# EAGLE schematic pcb l4 v18 (EAGLE 9.7.0)

## Sheet 1 of 6
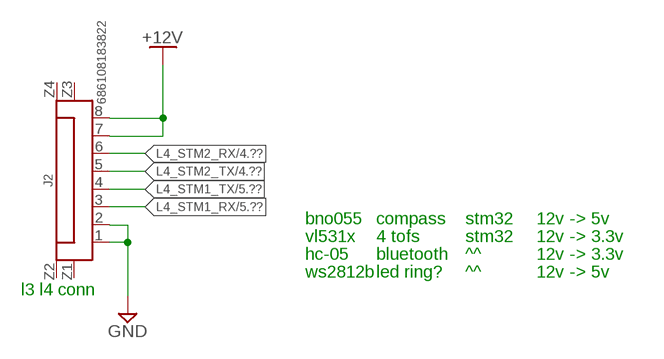
[diagram p0: schematic, sheet 1]

### Parts
J2  686108183822  6861XX183822_686108183822  [686108183822]

### Nets
+12V: J2.7 J2.8 ; also sheet 3
GND: J2.1 J2.2 ; also sheet 2,3,4,5,6
L4_STM1_RX: J2.3 ; also sheet 5
L4_STM1_TX: J2.4 ; also sheet 5
L4_STM2_RX: J2.6 ; also sheet 4
L4_STM2_TX: J2.5 ; also sheet 4
Unconnected: J2.Z1 J2.Z2 J2.Z3 J2.Z4

### Notes on the sheet
- bno055 | compass | stm32 | 12v -> 5v
- vl531x | 4 tofs | stm32 | 12v -> 3.3v
- hc-05 | bluetooth | ^^ | 12v -> 3.3v
- ws2812b | led ring? | ^^ | 12v -> 5v
- l3 l4 conn

## Sheet 2 of 6
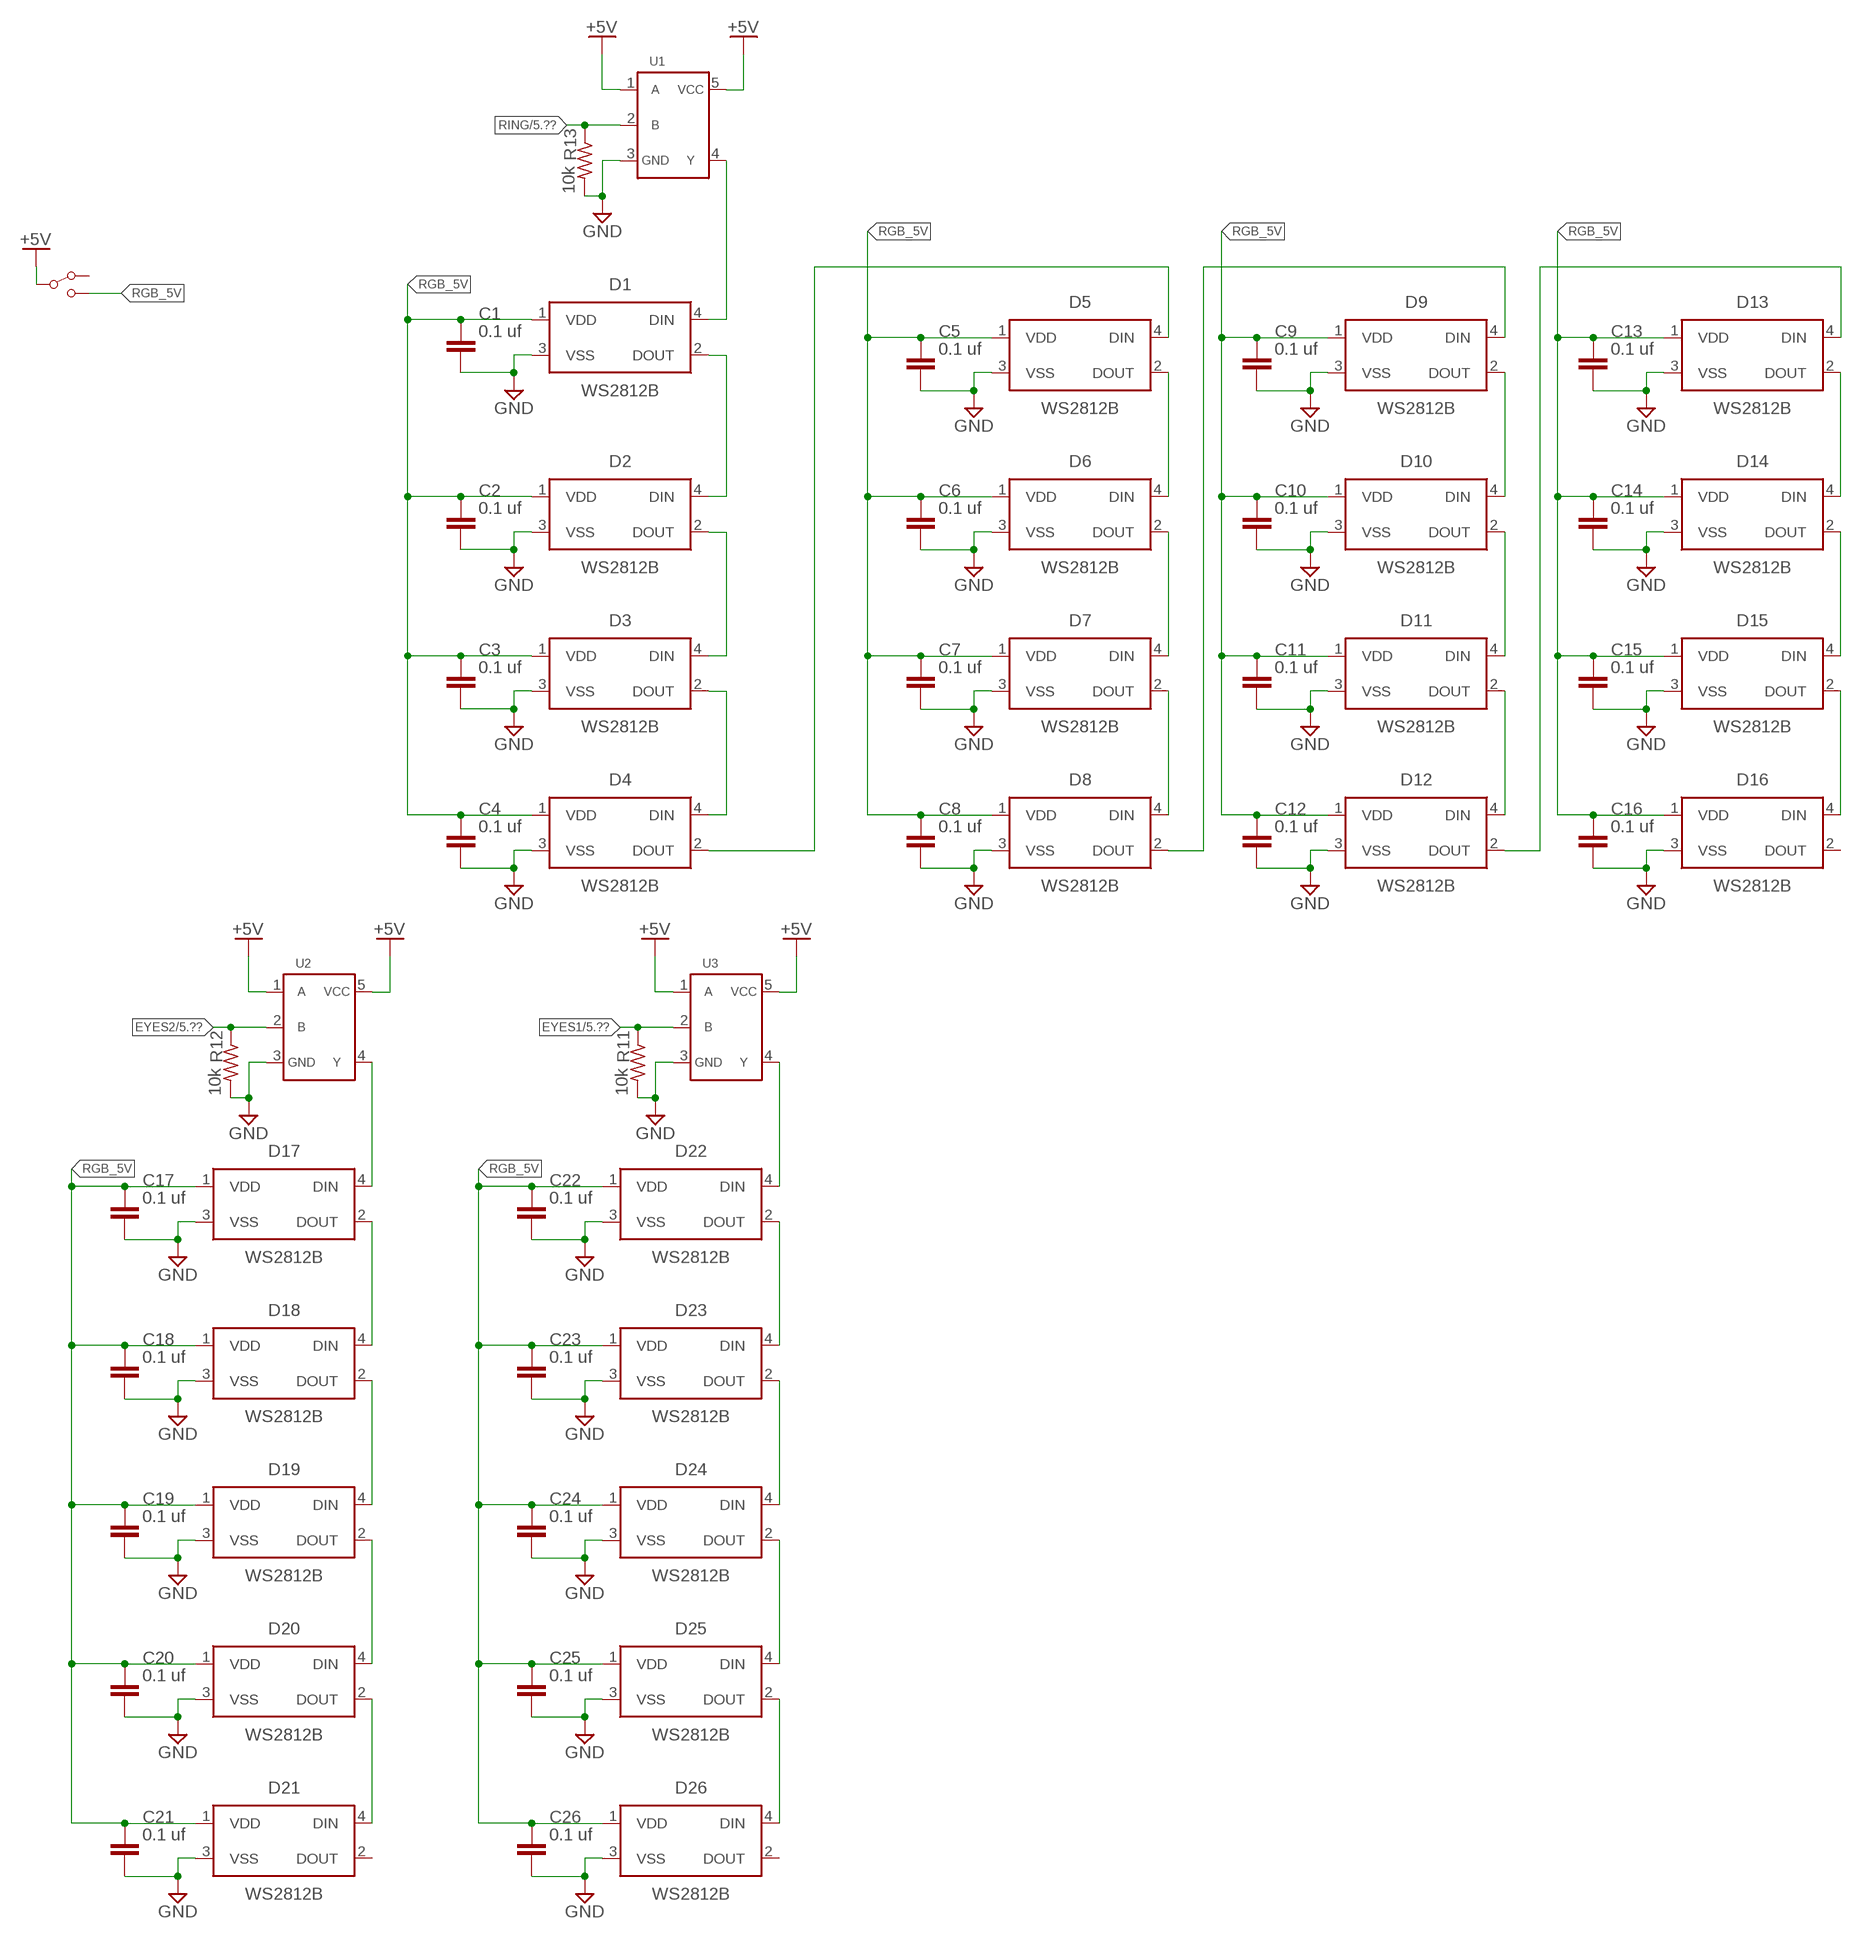
[diagram p1: schematic, sheet 2]

### Parts
C1  0.1 uf  C_CHIP-0603(1608-METRIC)  [CAPC1608X85]
C2  0.1 uf  C_CHIP-0603(1608-METRIC)  [CAPC1608X85]
C3  0.1 uf  C_CHIP-0603(1608-METRIC)  [CAPC1608X85]
C4  0.1 uf  C_CHIP-0603(1608-METRIC)  [CAPC1608X85]
C5  0.1 uf  C_CHIP-0603(1608-METRIC)  [CAPC1608X85]
C6  0.1 uf  C_CHIP-0603(1608-METRIC)  [CAPC1608X85]
C7  0.1 uf  C_CHIP-0603(1608-METRIC)  [CAPC1608X85]
C8  0.1 uf  C_CHIP-0603(1608-METRIC)  [CAPC1608X85]
C9  0.1 uf  C_CHIP-0603(1608-METRIC)  [CAPC1608X85]
C10  0.1 uf  C_CHIP-0603(1608-METRIC)  [CAPC1608X85]
C11  0.1 uf  C_CHIP-0603(1608-METRIC)  [CAPC1608X85]
C12  0.1 uf  C_CHIP-0603(1608-METRIC)  [CAPC1608X85]
C13  0.1 uf  C_CHIP-0603(1608-METRIC)  [CAPC1608X85]
C14  0.1 uf  C_CHIP-0603(1608-METRIC)  [CAPC1608X85]
C15  0.1 uf  C_CHIP-0603(1608-METRIC)  [CAPC1608X85]
C16  0.1 uf  C_CHIP-0603(1608-METRIC)  [CAPC1608X85]
C17  0.1 uf  C_CHIP-0603(1608-METRIC)  [CAPC1608X85]
C18  0.1 uf  C_CHIP-0603(1608-METRIC)  [CAPC1608X85]
C19  0.1 uf  C_CHIP-0603(1608-METRIC)  [CAPC1608X85]
C20  0.1 uf  C_CHIP-0603(1608-METRIC)  [CAPC1608X85]
C21  0.1 uf  C_CHIP-0603(1608-METRIC)  [CAPC1608X85]
C22  0.1 uf  C_CHIP-0603(1608-METRIC)  [CAPC1608X85]
C23  0.1 uf  C_CHIP-0603(1608-METRIC)  [CAPC1608X85]
C24  0.1 uf  C_CHIP-0603(1608-METRIC)  [CAPC1608X85]
C25  0.1 uf  C_CHIP-0603(1608-METRIC)  [CAPC1608X85]
C26  0.1 uf  C_CHIP-0603(1608-METRIC)  [CAPC1608X85]
D1  WS2812B  [WS2812B]
D2  WS2812B  [WS2812B]
D3  WS2812B  [WS2812B]
D4  WS2812B  [WS2812B]
D5  WS2812B  [WS2812B]
D6  WS2812B  [WS2812B]
D7  WS2812B  [WS2812B]
D8  WS2812B  [WS2812B]
D9  WS2812B  [WS2812B]
D10  WS2812B  [WS2812B]
D11  WS2812B  [WS2812B]
D12  WS2812B  [WS2812B]
D13  WS2812B  [WS2812B]
D14  WS2812B  [WS2812B]
D15  WS2812B  [WS2812B]
D16  WS2812B  [WS2812B]
D17  WS2812B  [WS2812B]
D18  WS2812B  [WS2812B]
D19  WS2812B  [WS2812B]
D20  WS2812B  [WS2812B]
D21  WS2812B  [WS2812B]
D22  WS2812B  [WS2812B]
D23  WS2812B  [WS2812B]
D24  WS2812B  [WS2812B]
D25  WS2812B  [WS2812B]
D26  WS2812B  [WS2812B]
R11  10k  R-US_CHIP-0603(1608-METRIC)  [RESC1608X60]
R12  10k  R-US_CHIP-0603(1608-METRIC)  [RESC1608X60]
R13  10k  R-US_CHIP-0603(1608-METRIC)  [RESC1608X60]
S1  SPDT-SLIDE-SWITCHSWITCH-TH  [SWITCH-TH]
U1  SN74AHCT1G08  [SOT23-5]
U2  SN74AHCT1G08  [SOT23-5]
U3  SN74AHCT1G08  [SOT23-5]

### Nets
+5V: S1.P$2 U1.1 U1.5 U2.1 U2.5 U3.1 U3.5 ; also sheet 3,6
EYES1: R11.1 U3.2 ; also sheet 5
EYES2: R12.1 U2.2 ; also sheet 5
GND: C1.2 C2.2 C3.2 C4.2 C5.2 C6.2 C7.2 C8.2 C9.2 C10.2 C11.2 C12.2 C13.2 C14.2 C15.2 C16.2 C17.2 C18.2 C19.2 C20.2 C21.2 C22.2 C23.2 C24.2 C25.2 C26.2 D1.3(VSS) D2.3(VSS) D3.3(VSS) D4.3(VSS) D5.3(VSS) D6.3(VSS) D7.3(VSS) D8.3(VSS) D9.3(VSS) D10.3(VSS) D11.3(VSS) D12.3(VSS) D13.3(VSS) D14.3(VSS) D15.3(VSS) D16.3(VSS) D17.3(VSS) D18.3(VSS) D19.3(VSS) D20.3(VSS) D21.3(VSS) D22.3(VSS) D23.3(VSS) D24.3(VSS) D25.3(VSS) D26.3(VSS) R11.2 R12.2 R13.2 U1.3 U2.3 U3.3 ; also sheet 1,3,4,5,6
N$7: D1.2(DOUT) D2.4(DIN)
N$8: D2.2(DOUT) D3.4(DIN)
N$9: D3.2(DOUT) D4.4(DIN)
N$10: D9.2(DOUT) D10.4(DIN)
N$11: D10.2(DOUT) D11.4(DIN)
N$12: D1.4(DIN) U1.4
N$13: D11.2(DOUT) D12.4(DIN)
N$14: D15.2(DOUT) D16.4(DIN)
N$15: D14.2(DOUT) D15.4(DIN)
N$16: D13.2(DOUT) D14.4(DIN)
N$17: D5.2(DOUT) D6.4(DIN)
N$18: D6.2(DOUT) D7.4(DIN)
N$19: D7.2(DOUT) D8.4(DIN)
N$20: D8.2(DOUT) D9.4(DIN)
N$21: D12.2(DOUT) D13.4(DIN)
N$22: D4.2(DOUT) D5.4(DIN)
N$23: D20.2(DOUT) D21.4(DIN)
N$24: D19.2(DOUT) D20.4(DIN)
N$25: D18.2(DOUT) D19.4(DIN)
N$26: D17.2(DOUT) D18.4(DIN)
N$27: D22.2(DOUT) D23.4(DIN)
N$28: D23.2(DOUT) D24.4(DIN)
N$29: D24.2(DOUT) D25.4(DIN)
N$30: D25.2(DOUT) D26.4(DIN)
N$31: D22.4(DIN) U3.4
N$32: D17.4(DIN) U2.4
RGB_5V: C1.1 C2.1 C3.1 C4.1 C5.1 C6.1 C7.1 C8.1 C9.1 C10.1 C11.1 C12.1 C13.1 C14.1 C15.1 C16.1 C17.1 C18.1 C19.1 C20.1 C21.1 C22.1 C23.1 C24.1 C25.1 C26.1 D1.1(VDD) D2.1(VDD) D3.1(VDD) D4.1(VDD) D5.1(VDD) D6.1(VDD) D7.1(VDD) D8.1(VDD) D9.1(VDD) D10.1(VDD) D11.1(VDD) D12.1(VDD) D13.1(VDD) D14.1(VDD) D15.1(VDD) D16.1(VDD) D17.1(VDD) D18.1(VDD) D19.1(VDD) D20.1(VDD) D21.1(VDD) D22.1(VDD) D23.1(VDD) D24.1(VDD) D25.1(VDD) D26.1(VDD) S1.P$3
RING: R13.1 U1.2 ; also sheet 5
Unconnected: D16.2(DOUT) D21.2(DOUT) D26.2(DOUT) S1.P$1

## Sheet 3 of 6
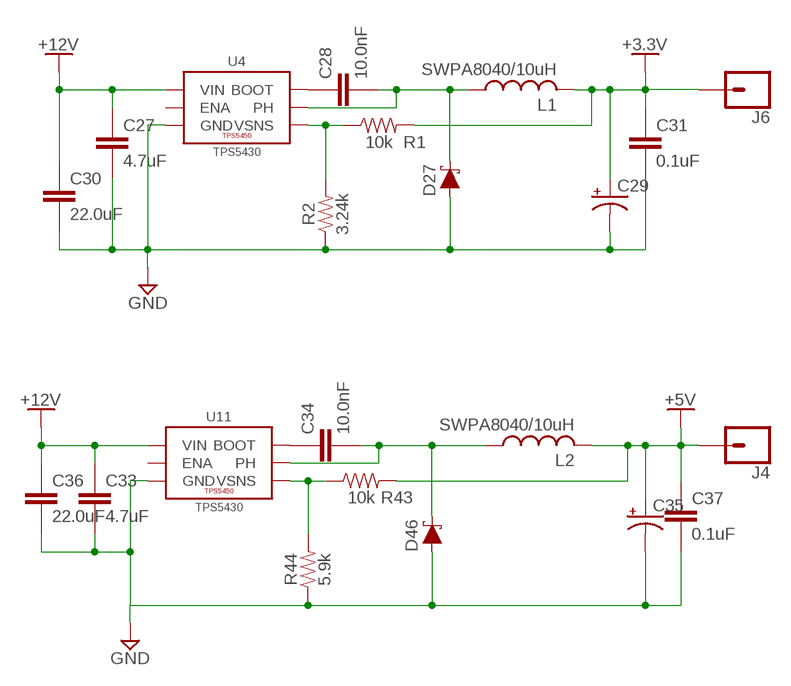
[diagram p2: schematic, sheet 3]

### Parts
C27  4.7uF  CAPACITOR0603  [C0603]
C28  10.0nF  CAPACITOR0603  [C0603]
C29  220uF  CPOL-USD/7343-31R  [D/7343-31R]
C30  22.0uF  CAPACITOR1210  [C1210]
C31  0.1uF  CAPACITOR0603  [C0603]
C33  4.7uF  CAPACITOR0603  [C0603]
C34  10.0nF  CAPACITOR0603  [C0603]
C35  220uF  CPOL-USD/7343-31R  [D/7343-31R]
C36  22.0uF  CAPACITOR1210  [C1210]
C37  0.1uF  CAPACITOR0603  [C0603]
D27  3A/40V/500mV  DIODE-SCHOTTKY-B340A  [SMA-DIODE]
D46  3A/40V/500mV  DIODE-SCHOTTKY-B340A  [SMA-DIODE]
J4  CONN_01  [1X01]
J6  CONN_01  [1X01]
L1  SWPA8040/10uH  INDUCTORSWPA8040  [SWPA8040]
L2  SWPA8040/10uH  INDUCTORSWPA8040  [SWPA8040]
R1  10k  RESISTOR0603  [R0603]
R2  3.24k  RESISTOR0603  [R0603]
R43  10k  RESISTOR0603  [R0603]
R44  5.9k  RESISTOR0603  [R0603]
U4  TPS5430  TPS5450  [POWERPAD-SOIC-8]
U11  TPS5430  TPS5450  [POWERPAD-SOIC-8]

### Nets
+3.3V: C29.+ C31.1 J6.1 L1.P2 R1.2 ; also sheet 4,5,6
+5V: C35.+ C37.1 J4.1 L2.P2 R43.2 ; also sheet 2,6
+12V: C27.1 C30.1 C33.1 C36.1 U4.7(VIN) U11.7(VIN) ; also sheet 1
GND: C27.2 C29.- C30.2 C31.2 C33.2 C35.- C36.2 C37.2 D27.A D46.A R2.1 R44.1 U4.6(GND) U4.9(GND) U4.P$1(GND) U4.P$2(GND) U4.P$3(GND) U4.P$4(GND) U4.P$5(GND) U4.P$6(GND) U11.6(GND) U11.9(GND) U11.P$1(GND) U11.P$2(GND) U11.P$3(GND) U11.P$4(GND) U11.P$5(GND) U11.P$6(GND) ; also sheet 1,2,4,5,6
N$6: C28.2 D27.C L1.P1 U4.8(PH)
N$33: R1.1 R2.2 U4.4(VSNS)
N$34: C28.1 U4.1(BOOT)
N$45: C34.2 D46.C L2.P1 U11.8(PH)
N$96: R43.1 R44.2 U11.4(VSNS)
N$97: C34.1 U11.1(BOOT)
Unconnected: U4.2(NC) U4.3(NC) U4.5(ENA) U11.2(NC) U11.3(NC) U11.5(ENA)

## Sheet 4 of 6
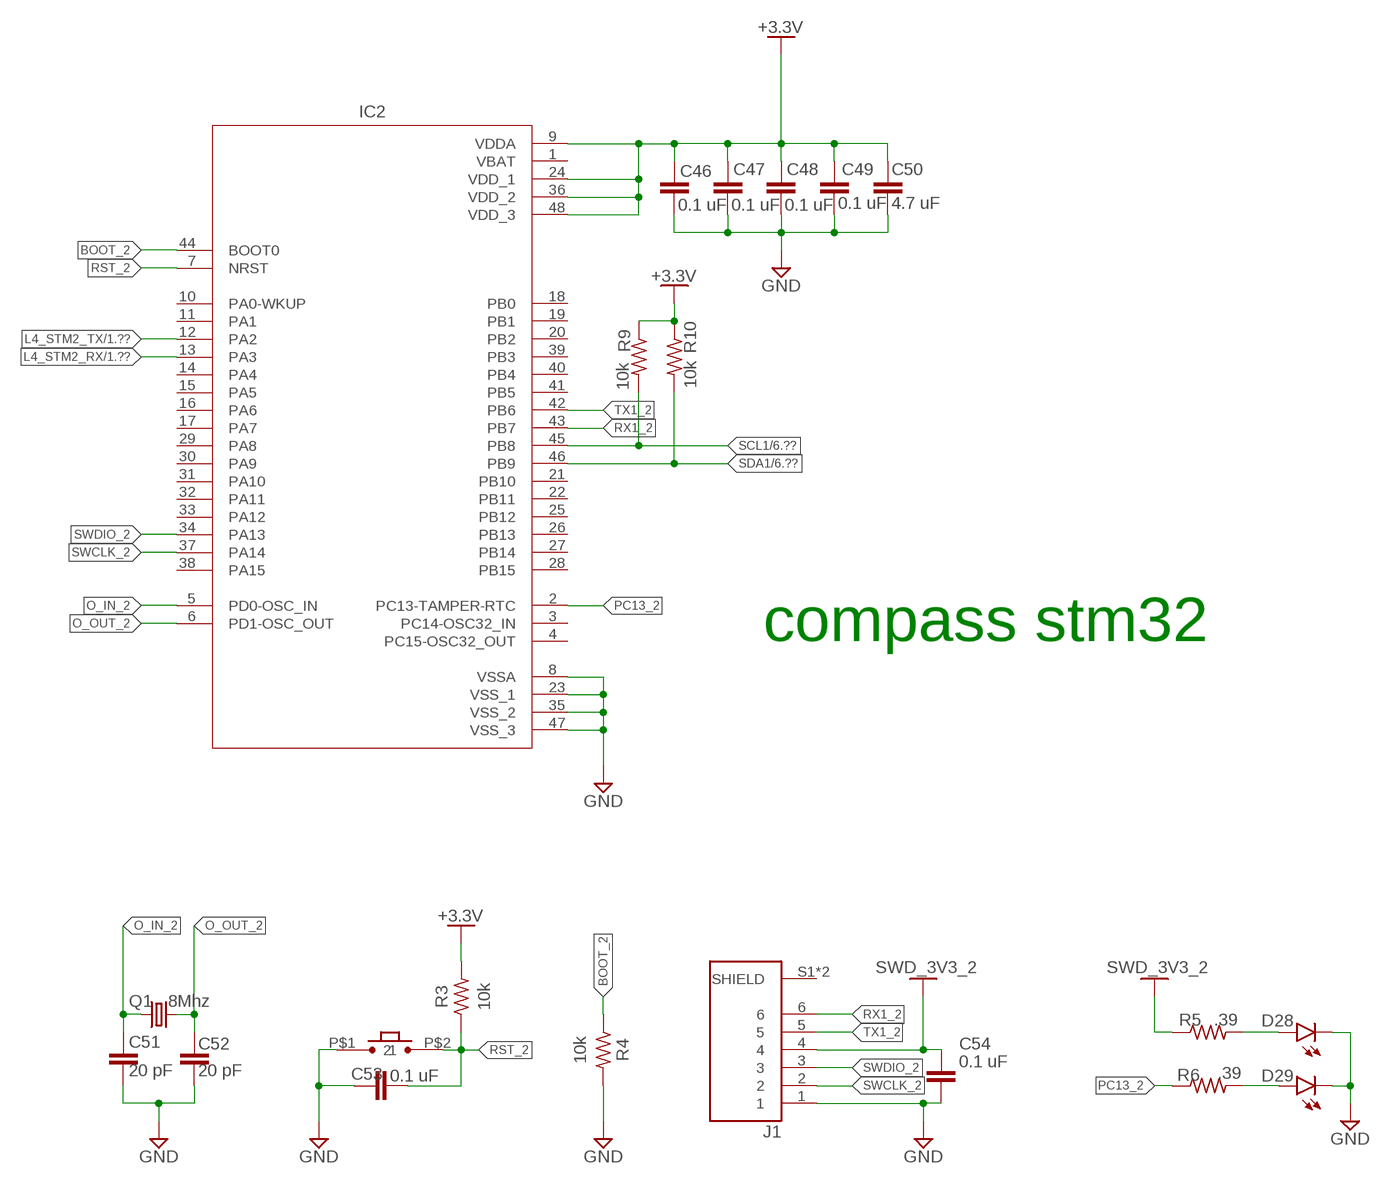
[diagram p3: schematic, sheet 4]

### Parts
C46  0.1 uF  C_CHIP-0603(1608-METRIC)  [CAPC1608X85]
C47  0.1 uF  C_CHIP-0603(1608-METRIC)  [CAPC1608X85]
C48  0.1 uF  C_CHIP-0603(1608-METRIC)  [CAPC1608X85]
C49  0.1 uF  C_CHIP-0603(1608-METRIC)  [CAPC1608X85]
C50  4.7 uF  C_CHIP-0603(1608-METRIC)  [CAPC1608X85]
C51  20 pF  C_CHIP-0603(1608-METRIC)  [CAPC1608X85]
C52  20 pF  C_CHIP-0603(1608-METRIC)  [CAPC1608X85]
C53  0.1 uF  C_CHIP-0603(1608-METRIC)  [CAPC1608X85]
C54  0.1 uF  C_CHIP-0603(1608-METRIC)  [CAPC1608X85]
D28  CHIP-FLAT-G_0603-0.35MM  [LEDC1608X35N_FLAT-G]
D29  CHIP-FLAT-G_0603-0.35MM  [LEDC1608X35N_FLAT-G]
IC2  STM32F103_QFP  [QFP50P900X900X160-48N]
J1  SM06B-SRSS-TB(LF)(SN)  [JST_SM06B-SRSS-TB(LF)(SN)]
Q1  8Mhz  CRYSTALCTS406  [CTS406]
R3  10k  R-US_CHIP-0603(1608-METRIC)  [RESC1608X60]
R4  10k  R-US_CHIP-0603(1608-METRIC)  [RESC1608X60]
R5  .39  R-US_CHIP-0603(1608-METRIC)  [RESC1608X60]
R6  .39  R-US_CHIP-0603(1608-METRIC)  [RESC1608X60]
R9  10k  R-US_CHIP-0603(1608-METRIC)  [RESC1608X60]
R10  10k  R-US_CHIP-0603(1608-METRIC)  [RESC1608X60]
U$2  SMOL_TACTILE_3X4MM  [SMOL_TACTILE_3X4MM]

### Nets
+3.3V: C46.1 C47.1 C48.1 C49.1 C50.1 IC2.9(VDDA) IC2.24(VDD_1) IC2.36(VDD_2) IC2.48(VDD_3) R3.2 R9.1 R10.1 ; also sheet 3,5,6
BOOT_2: IC2.44(BOOT0) R4.1
GND: C46.2 C47.2 C48.2 C49.2 C50.2 C51.2 C52.2 C53.1 C54.2 D28.C D29.C IC2.8(VSSA) IC2.23(VSS_1) IC2.35(VSS_2) IC2.47(VSS_3) J1.1 R4.2 U$2.P$1 ; also sheet 1,2,3,5,6
L4_STM2_RX: IC2.13(PA3) ; also sheet 1
L4_STM2_TX: IC2.12(PA2) ; also sheet 1
N$35: D28.A R5.2
N$36: D29.A R6.2
O_IN_2: C51.1 IC2.5(PD0-OSC_IN) Q1.1
O_OUT_2: C52.1 IC2.6(PD1-OSC_OUT) Q1.3
PC13_2: IC2.2(PC13-TAMPER-RTC) R6.1
RST_2: C53.2 IC2.7(NRST) R3.1 U$2.P$2
RX1_2: IC2.43(PB7) J1.6
SCL1: IC2.45(PB8) R9.2 ; also sheet 6
SDA1: IC2.46(PB9) R10.2 ; also sheet 6
SWCLK_2: IC2.37(PA14) J1.2
SWD_3V3_2: C54.1 J1.4 R5.1
SWDIO_2: IC2.34(PA13) J1.3
TX1_2: IC2.42(PB6) J1.5
Unconnected: IC2.3(PC14-OSC32_IN) IC2.4(PC15-OSC32_OUT) IC2.10(PA0-WKUP) IC2.11(PA1) IC2.14(PA4) IC2.15(PA5) IC2.16(PA6) IC2.17(PA7) IC2.18(PB0) IC2.19(PB1) IC2.20(PB2) IC2.21(PB10) IC2.22(PB11) IC2.25(PB12) IC2.26(PB13) IC2.27(PB14) IC2.28(PB15) IC2.29(PA8) IC2.30(PA9) IC2.31(PA10) IC2.32(PA11) IC2.33(PA12) IC2.38(PA15) IC2.39(PB3) IC2.40(PB4) IC2.41(PB5) J1.S1(SHIELD) J1.S2(SHIELD)

### Notes on the sheet
- compass stm32

## Sheet 5 of 6
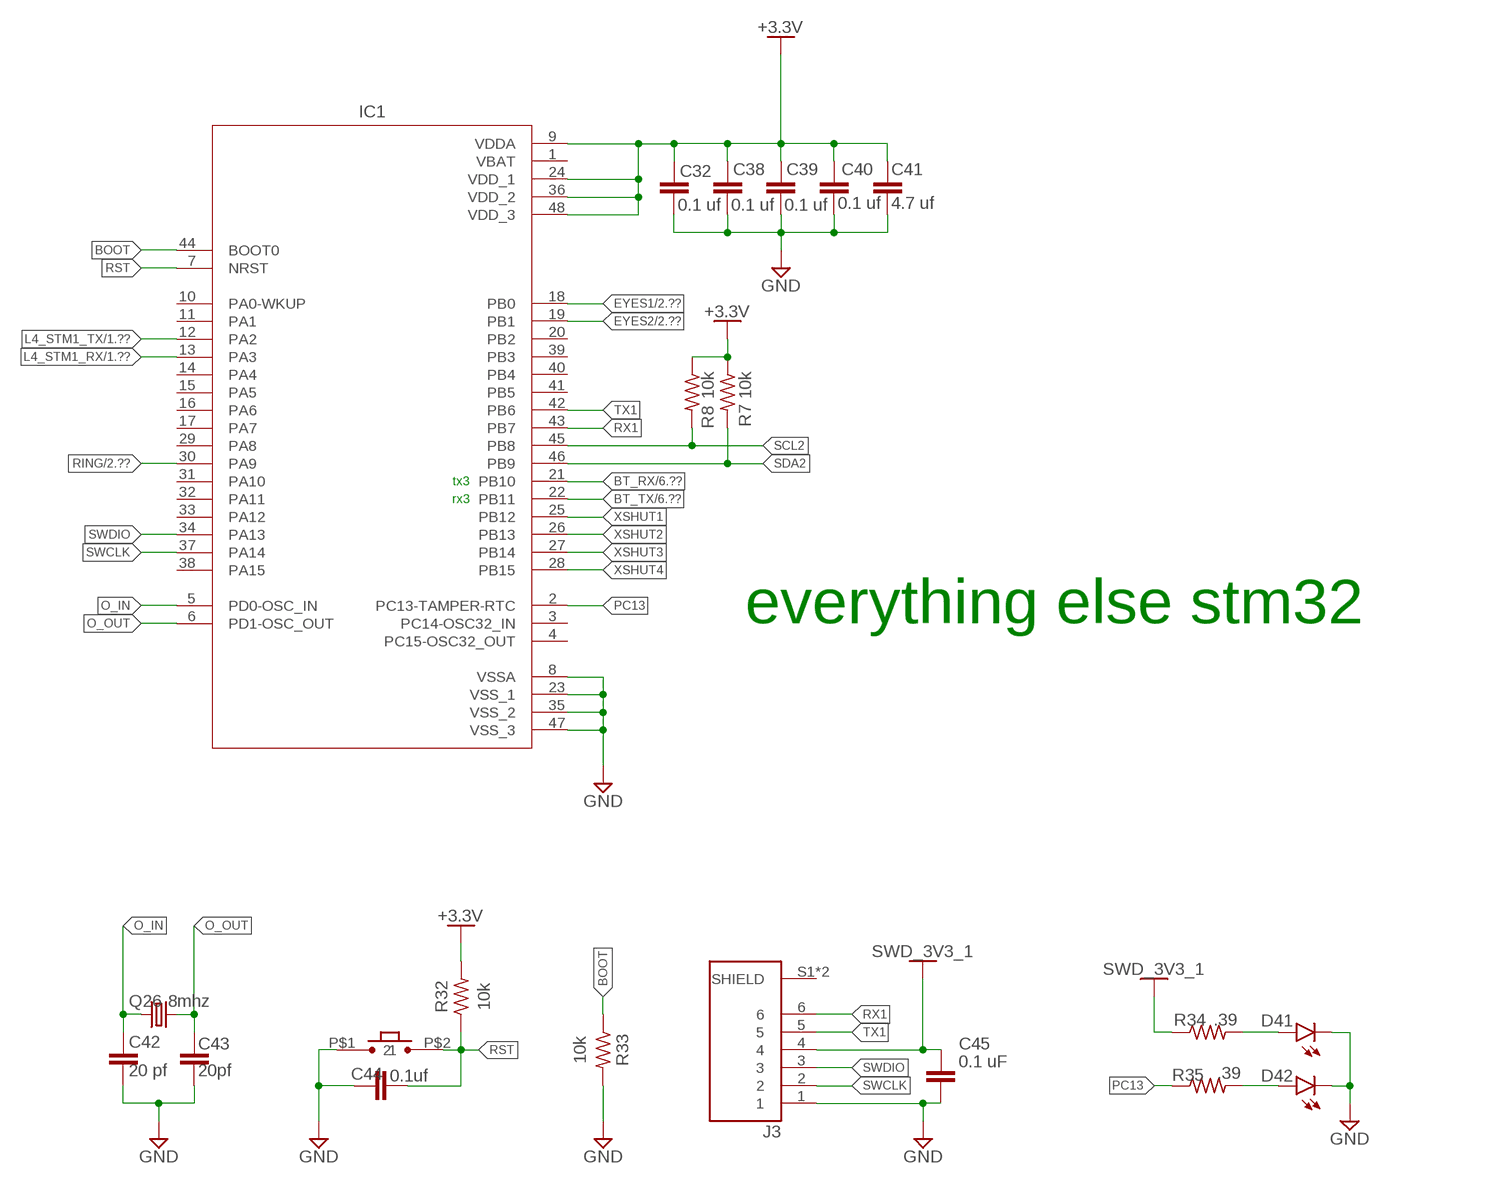
[diagram p4: schematic, sheet 5]

### Parts
C32  0.1 uf  C_CHIP-0603(1608-METRIC)  [CAPC1608X85]
C38  0.1 uf  C_CHIP-0603(1608-METRIC)  [CAPC1608X85]
C39  0.1 uf  C_CHIP-0603(1608-METRIC)  [CAPC1608X85]
C40  0.1 uf  C_CHIP-0603(1608-METRIC)  [CAPC1608X85]
C41  4.7 uf  C_CHIP-0603(1608-METRIC)  [CAPC1608X85]
C42  20 pf  C_CHIP-0603(1608-METRIC)  [CAPC1608X85]
C43  20pf  C_CHIP-0603(1608-METRIC)  [CAPC1608X85]
C44  0.1uf  C_CHIP-0603(1608-METRIC)  [CAPC1608X85]
C45  0.1 uF  C_CHIP-0603(1608-METRIC)  [CAPC1608X85]
D41  CHIP-FLAT-G_0603-0.35MM  [LEDC1608X35N_FLAT-G]
D42  CHIP-FLAT-G_0603-0.35MM  [LEDC1608X35N_FLAT-G]
IC1  STM32F103_QFP  [QFP50P900X900X160-48N]
J3  SM06B-SRSS-TB(LF)(SN)  [JST_SM06B-SRSS-TB(LF)(SN)]
Q26  8mhz  CRYSTALCTS406  [CTS406]
R7  10k  R-US_CHIP-0603(1608-METRIC)  [RESC1608X60]
R8  10k  R-US_CHIP-0603(1608-METRIC)  [RESC1608X60]
R32  10k  R-US_CHIP-0603(1608-METRIC)  [RESC1608X60]
R33  10k  R-US_CHIP-0603(1608-METRIC)  [RESC1608X60]
R34  .39  R-US_CHIP-0603(1608-METRIC)  [RESC1608X60]
R35  .39  R-US_CHIP-0603(1608-METRIC)  [RESC1608X60]
U$1  SMOL_TACTILE_3X4MM  [SMOL_TACTILE_3X4MM]

### Nets
+3.3V: C32.1 C38.1 C39.1 C40.1 C41.1 IC1.9(VDDA) IC1.24(VDD_1) IC1.36(VDD_2) IC1.48(VDD_3) R7.1 R8.1 R32.2 ; also sheet 3,4,6
BOOT: IC1.44(BOOT0) R33.1
BT_RX: IC1.21(PB10) ; also sheet 6
BT_TX: IC1.22(PB11) ; also sheet 6
EYES1: IC1.18(PB0) ; also sheet 2
EYES2: IC1.19(PB1) ; also sheet 2
GND: C32.2 C38.2 C39.2 C40.2 C41.2 C42.2 C43.2 C44.1 C45.2 D41.C D42.C IC1.8(VSSA) IC1.23(VSS_1) IC1.35(VSS_2) IC1.47(VSS_3) J3.1 R33.2 U$1.P$1 ; also sheet 1,2,3,4,6
L4_STM1_RX: IC1.13(PA3) ; also sheet 1
L4_STM1_TX: IC1.12(PA2) ; also sheet 1
N$46: D41.A R34.2
N$52: D42.A R35.2
O_IN: C42.1 IC1.5(PD0-OSC_IN) Q26.1
O_OUT: C43.1 IC1.6(PD1-OSC_OUT) Q26.3
PC13: IC1.2(PC13-TAMPER-RTC) R35.1
RING: IC1.30(PA9) ; also sheet 2
RST: C44.2 IC1.7(NRST) R32.1 U$1.P$2
RX1: IC1.43(PB7) J3.6
SCL2: IC1.45(PB8) R8.2 ; also sheet 6
SDA2: IC1.46(PB9) R7.2 ; also sheet 6
SWCLK: IC1.37(PA14) J3.2
SWD_3V3_1: C45.1 J3.4 R34.1
SWDIO: IC1.34(PA13) J3.3
TX1: IC1.42(PB6) J3.5
XSHUT1: IC1.25(PB12) ; also sheet 6
XSHUT2: IC1.26(PB13) ; also sheet 6
XSHUT3: IC1.27(PB14) ; also sheet 6
XSHUT4: IC1.28(PB15) ; also sheet 6
Unconnected: IC1.3(PC14-OSC32_IN) IC1.4(PC15-OSC32_OUT) IC1.10(PA0-WKUP) IC1.11(PA1) IC1.14(PA4) IC1.15(PA5) IC1.16(PA6) IC1.17(PA7) IC1.20(PB2) IC1.29(PA8) IC1.31(PA10) IC1.32(PA11) IC1.33(PA12) IC1.38(PA15) IC1.39(PB3) IC1.40(PB4) IC1.41(PB5) J3.S1(SHIELD) J3.S2(SHIELD)

### Notes on the sheet
- tx3
- rx3
- everything else stm32

## Sheet 6 of 6
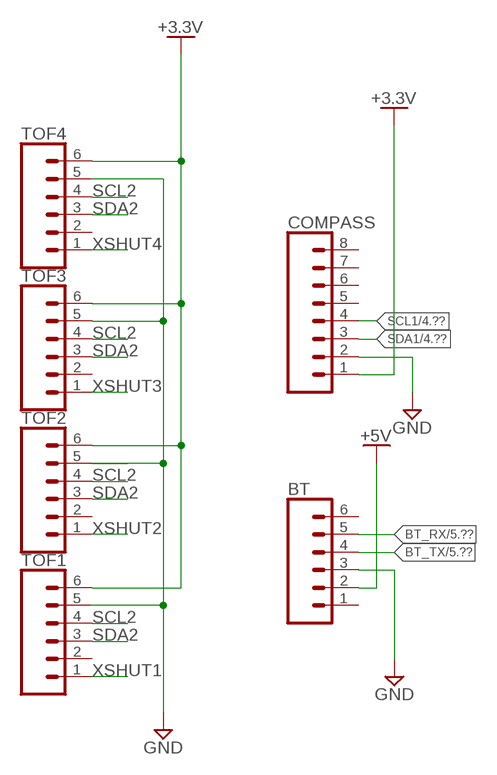
[diagram p5: schematic, sheet 6]

### Parts
BT  CONN_06LOCK  [1X06_LOCK]
COMPASS  CONN_08LOCK  [1X08_LOCK]
TOF1  CONN_06LOCK  [1X06_LOCK]
TOF2  CONN_06LOCK  [1X06_LOCK]
TOF3  CONN_06LOCK  [1X06_LOCK]
TOF4  CONN_06LOCK  [1X06_LOCK]

### Nets
+3.3V: COMPASS.1 TOF1.6 TOF2.6 TOF3.6 TOF4.6 ; also sheet 3,4,5
+5V: BT.2 ; also sheet 2,3
BT_RX: BT.5 ; also sheet 5
BT_TX: BT.4 ; also sheet 5
GND: BT.3 COMPASS.2 TOF1.5 TOF2.5 TOF3.5 TOF4.5 ; also sheet 1,2,3,4,5
SCL1: COMPASS.4 ; also sheet 4
SCL2: TOF1.4 TOF2.4 TOF3.4 TOF4.4 ; also sheet 5
SDA1: COMPASS.3 ; also sheet 4
SDA2: TOF1.3 TOF2.3 TOF3.3 TOF4.3 ; also sheet 5
XSHUT1: TOF1.1 ; also sheet 5
XSHUT2: TOF2.1 ; also sheet 5
XSHUT3: TOF3.1 ; also sheet 5
XSHUT4: TOF4.1 ; also sheet 5
Unconnected: BT.1 BT.6 COMPASS.5 COMPASS.6 COMPASS.7 COMPASS.8 TOF1.2 TOF2.2 TOF3.2 TOF4.2

## Power pins joined to a net without a drawn wire
VBAT: IC1.1(VBAT) IC2.1(VBAT)

## Library data of the parts
BT TOF1-TOF4 = SparkFun-Connectors:CONN_06: Multi connection point. Often used as Generic Header-pin footprint for 0.1 inch spaced/style header connections On any of the 0.1 inch spaced packages, you can populate with these: Break Away Headers - Straight <https://www.sparkfun.com/products/116> (PRT-00116) Break Away Male Headers - Right Angle <https://www.sparkfun.com/products/553> (PRT-00553) Female Headers <https://www.sparkfun.com/products/115> (PRT-00115) Break Away Headers - Machine Pin <https://www.sparkfun.com/products/117> (PRT-00117) Break Away Female Headers - Swiss Machine Pin <https://www.sparkfun.com/products/743> (PRT-00743) Arduino Stackable Header - 6 Pin <https://www.sparkfun.com/products/9280> (PRT-09280) For SCREWTERMINALS and SPRING TERMINALS visit here: Screw Terimnals on SparkFun.com <https://www.sparkfun.com/search/results?term=Screw+Terminals> (5mm/3.5mm/2.54mm spacing) This device is also useful as a general connection point to wire up your design to another part of your project. Our various solder wires solder well into these plated through hole pads. Hook-Up Wire - Assortment (Stranded, 22 AWG) <https://www.sparkfun.com/products/11375> (PRT-11375) Hook-Up Wire - Assortment (Solid Core, 22 AWG) <https://www.sparkfun.com/products/11367> (PRT-11367) View the entire wire category on our website here <https://www.sparkfun.com/categories/141>
C1-C26 C32 C38-C54 = Capacitor:C: Capacitor - Generic; CATEGORY: Capacitor
C27 C28 C30 C31 C33 C34 C36 C37 = JH:CAPACITOR
C29 C35 = rcl:CPOL-US: POLARIZED CAPACITOR, American symbol; SPICEPREFIX: C
COMPASS = SparkFun-Connectors:CONN_08: Multi connection point. Often used as Generic Header-pin footprint for 0.1 inch spaced/style header connections On any of the 0.1 inch spaced packages, you can populate with these: Break Away Headers - Straight <https://www.sparkfun.com/products/116> (PRT-00116) Break Away Male Headers - Right Angle <https://www.sparkfun.com/products/553> (PRT-00553) Female Headers <https://www.sparkfun.com/products/115> (PRT-00115) Break Away Headers - Machine Pin <https://www.sparkfun.com/products/117> (PRT-00117) Break Away Female Headers - Swiss Machine Pin <https://www.sparkfun.com/products/743> (PRT-00743) Arduino Stackable Header - 8 Pin <https://www.sparkfun.com/products/9279> (PRT-09279) For SCREWTERMINALS and SPRING TERMINALS visit here: Screw Terimnals on SparkFun.com <https://www.sparkfun.com/search/results?term=Screw+Terminals> (5mm/3.5mm/2.54mm spacing) This device is also useful as a general connection point to wire up your design to another part of your project. Our various solder wires solder well into these plated through hole pads. Hook-Up Wire - Assortment (Stranded, 22 AWG) <https://www.sparkfun.com/products/11375> (PRT-11375) Hook-Up Wire - Assortment (Solid Core, 22 AWG) <https://www.sparkfun.com/products/11367> (PRT-11367) View the entire wire category on our website here <https://www.sparkfun.com/categories/141> Special notes: Molex polarized connector foot print use with SKU : PRT-08231 with associated crimp pins and housings. 1MM SMD Version SKU: PRT-10208 NOTES ON THE VARIANTS LOCK and LOCK_LONGPADS... This footprint was designed to help hold the alignment of a through-hole component (i.e. 6-pin header) while soldering it into place. You may notice that each hole has been shifted either up or down by 0.005 of an inch from it's more standard position (which is a perfectly straight line). This slight alteration caused the pins (the squares in the middle) to touch the edges of the holes. Because they are alternating, it causes a "brace" to hold the component in place. 0.005 has proven to be the perfect amount of "off-center" position when using our standard breakaway headers. Although looks a little odd when you look at the bare footprint, once you have a header in there, the alteration is very hard to notice. Also,if you push a header all the way into place, it is covered up entirely on the bottom side.
D1-D26 = LED:WS2812B: Intelligent control LED integrated light source Datasheet <http://cdn.sparkfun.com/datasheets/BreakoutBoards/WS2812B.pdf>; CATEGORY: LED; COLOR: RGB; DESCRIPTION: LED integrated light source; MANUFACTURER: Worldsemi; MPN: WS2812B; OPERATING_TEMP: -25 ℃ to +80℃(TJ); PART_STATUS: Active; SUB_CATEGORY: RGB
D27 D46 = SparkFun-DiscreteSemi:DIODE-SCHOTTKY: Schottky diode A Schottky diode is a semiconductor diode which has a low forward voltage drop and a very fast switching action.; PROD_ID: DIO-09886
D28 D29 D41 D42 = LED:CHIP-FLAT-G; CATEGORY: LED; COLOR: GREEN; DESCRIPTION: CHIP LED FLAT; SUB-CATEGORY: CHIP; TYPE: FLAT_TOP; VALUE: LED_GREEN
IC1 IC2 = IC_Embedded:STM32F103: Medium-density performance line ARM®-based 32-bit MCU with 64 or 128 KB Flash, USB, CAN, 7 timers, 2 ADCs, 9 com. interfaces Datasheet <https://www.st.com/resource/en/datasheet/stm32f103c8.pdf>; CATEGORY: IC_Embedded; MANUFACTURER: ST Microelectronics; MPN: STM32F103C6T7A; OPERATING_TEMP: -40 to 105 °C; PART_STATUS: Active; SUB-CATEGORY: Microcontroller; THERMALLOSS: 0.44W; VALUE: STM32F103C6
J1 J3 = SM06B-SRSS-TB_LF__SN_:SM06B-SRSS-TB(LF)(SN): SH Series 6 Position 1 mm Surface Mount Right Angle Side Entry Shrouded Header; MANUFACTURER: JST; STANDARD: Manufacturer Recommendation
J2 = Wurth_Connectors_WR-FPC:6861XX183822_686108183822: WR-FPC 1.00 mm SMT ZIF Vertical Type A KIND PROPERTIES Pitch 1 mm MATERIAL PROPERTIES Insulator Material PA6T Contact Material Phosphor Bronze Contact Plating 120 (µ") Tin over 30 (µ") Nickel Solder Tabs Brass <https://www.we-online.com/catalog/media/o83988v209%20Family_WR-FPC_6861xx183822.jpg> Details see: https://www.we-online.com/catalog/en/FPC_1_00_SMT_ZIF_VERTICAL_TYPE_A_6861XX183822/ Updated by Ella Wu, 2020-08-25 2020 (C) Würth Elektronik; CONTACT-RESISTANCE: 30mOhm; DATASHEET-URL: https://www.we-online.com/catalog/datasheet/686108183822.pdf; IR: 1A; L: 14.8mm; MATE-WITH: WR-FFC 1.00 mm Flat Flexible Cable Type 1 (Contacts on same side)/ Type 2 (Contacts opposite); PACKAGING: Tape and Reel; PART-NUMBER: 686108183822; PINS: 8; PITCH: 1mm; TYPE: Vertical; WORKING-VOLTAGE: 125V(AC)
J4 J6 = SparkFun-Connectors:CONN_01: Single connection point. Often used as Generic Header-pin footprint for 0.1 inch spaced/style header connections On any of the 0.1 inch spaced packages, you can populate with these: Break Away Headers - Straight <https://www.sparkfun.com/products/116> (PRT-00116) Break Away Male Headers - Right Angle <https://www.sparkfun.com/products/553> (PRT-00553) Female Headers <https://www.sparkfun.com/products/115> (PRT-00115) Break Away Headers - Machine Pin <https://www.sparkfun.com/products/117> (PRT-00117) Break Away Female Headers - Swiss Machine Pin <https://www.sparkfun.com/products/743> (PRT-00743) This device is also useful as a general connection point to wire up your design to another part of your project. Our various solder wires solder well into these plated through hole pads. Hook-Up Wire - Assortment (Stranded, 22 AWG) <https://www.sparkfun.com/products/11375> (PRT-11375) Hook-Up Wire - Assortment (Solid Core, 22 AWG) <https://www.sparkfun.com/products/11367> (PRT-11367) View the entire wire category on our website here <https://www.sparkfun.com/categories/141> Special notes: SMTSO-256-ET is a "flush mount" nut for a 4-40 screw. We mostly use this on specialty testbeds; it is a nice way to connect hardware to your PCB at an adjustable hieght. Also note, the SNAP packages are for using a snappable style connector. We sell a baggie of snaps and they are also used on two LilyPad designs: Snap Assortment - 30 pack (male and female) <https://www.sparkfun.com/products/11347> (DEV-11347) LilyPad Arduino SimpleSnap <https://www.sparkfun.com/products/10941> (DEV-10941) LilyPad SimpleSnap Protoboard <https://www.sparkfun.com/products/10940> (DEV-10940)
L1 L2 = JH:INDUCTOR
Q1 Q26 = crystal:CRYSTAL: CRYSTAL; OC_FARNELL: unknown; OC_NEWARK: unknown
R1 R2 R43 R44 = JH:RESISTOR
R3-R13 R32-R35 = Resistor:R-US: Resistor Fixed - ANSI; CATEGORY: Resistor; SUB-CATEGORY: Fixed
S1 = i want to make my own parts:SPDT-SLIDE-SWITCH
U1-U3 = i want to make my own parts:SN74AHCT1G08
U4 U11 = JH:TPS5450
U$1 U$2 = smolswitch:SMOL_TACTILE_3X4MM